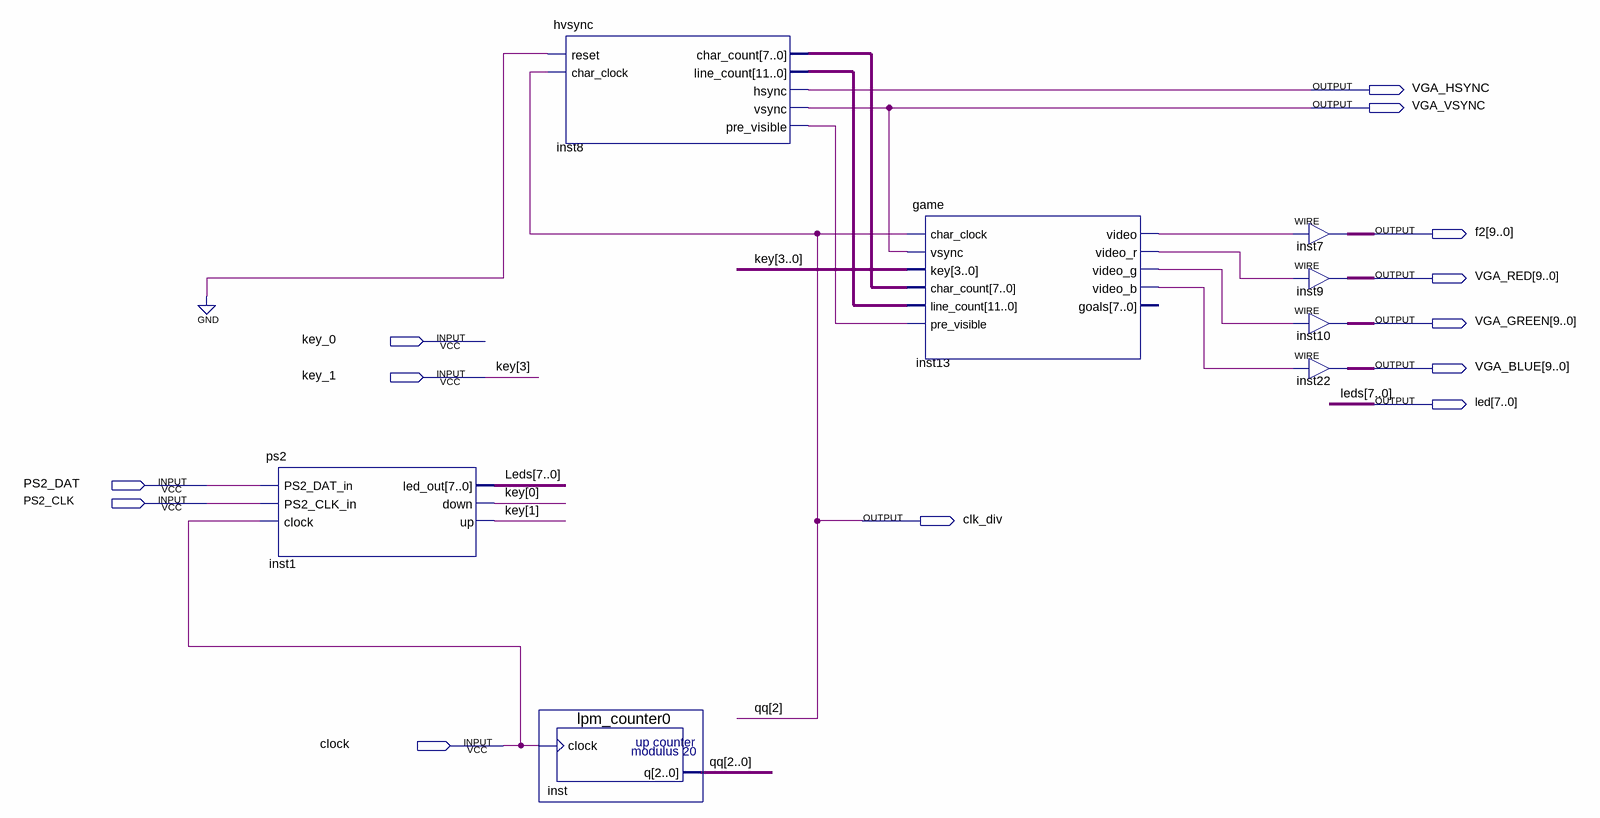
[diagram p0: schematic sheet]
// Quartus schematic max2.bdf as structural Verilog: 8 symbols, 13 pins
module max2 (
  input  key_0,
  input  key_1,
  input  PS2_DAT,
  input  PS2_CLK,
  input  clock,
  output VGA_HSYNC,
  output VGA_VSYNC,
  output [9:0] f2,
  output [9:0] VGA_RED,
  output [9:0] VGA_GREEN,
  output [9:0] VGA_BLUE,
  output [7:0] led,
  output clk_div
);

  wire inst8_pre_visible, inst13_video, inst13_video_b, inst13_video_g, inst13_video_r;
  wire [1:0] qq;
  wire [2:0] key;
  wire [7:0] inst8_char_count;
  wire [11:0] inst8_line_count;

  ps2 inst1 (.PS2_DAT_in(PS2_DAT), .PS2_CLK_in(PS2_CLK), .clock(clock), .led_out(led), .down(key[0]), .up(key[1]));
  hvsync inst8 (
    .reset(1'b0), .char_clock(clk_div), .char_count(inst8_char_count), .line_count(inst8_line_count),
    .hsync(VGA_HSYNC), .vsync(VGA_VSYNC), .pre_visible(inst8_pre_visible));
  lpm_counter0 inst (.clock(clock), .q({clk_div, qq}));
  game inst13 (
    .char_clock(clk_div), .vsync(VGA_VSYNC), .key({key_1, key}), .char_count(inst8_char_count),
    .line_count(inst8_line_count), .pre_visible(inst8_pre_visible), .video(inst13_video),
    .video_r(inst13_video_r), .video_g(inst13_video_g), .video_b(inst13_video_b));  // open: goals
  assign f2 = {10{inst13_video}};  // WIRE inst7
  assign VGA_RED = {10{inst13_video_r}};  // WIRE inst9
  assign VGA_GREEN = {10{inst13_video_g}};  // WIRE inst10
  assign VGA_BLUE = {10{inst13_video_b}};  // WIRE inst22

  // Other names for the same wires on the sheet: qq[2] = clk_div; key[3] = key_1; Leds[7:0] = led
endmodule
